# EAGLE design TI_DAC5V (EAGLE 9.6.2)
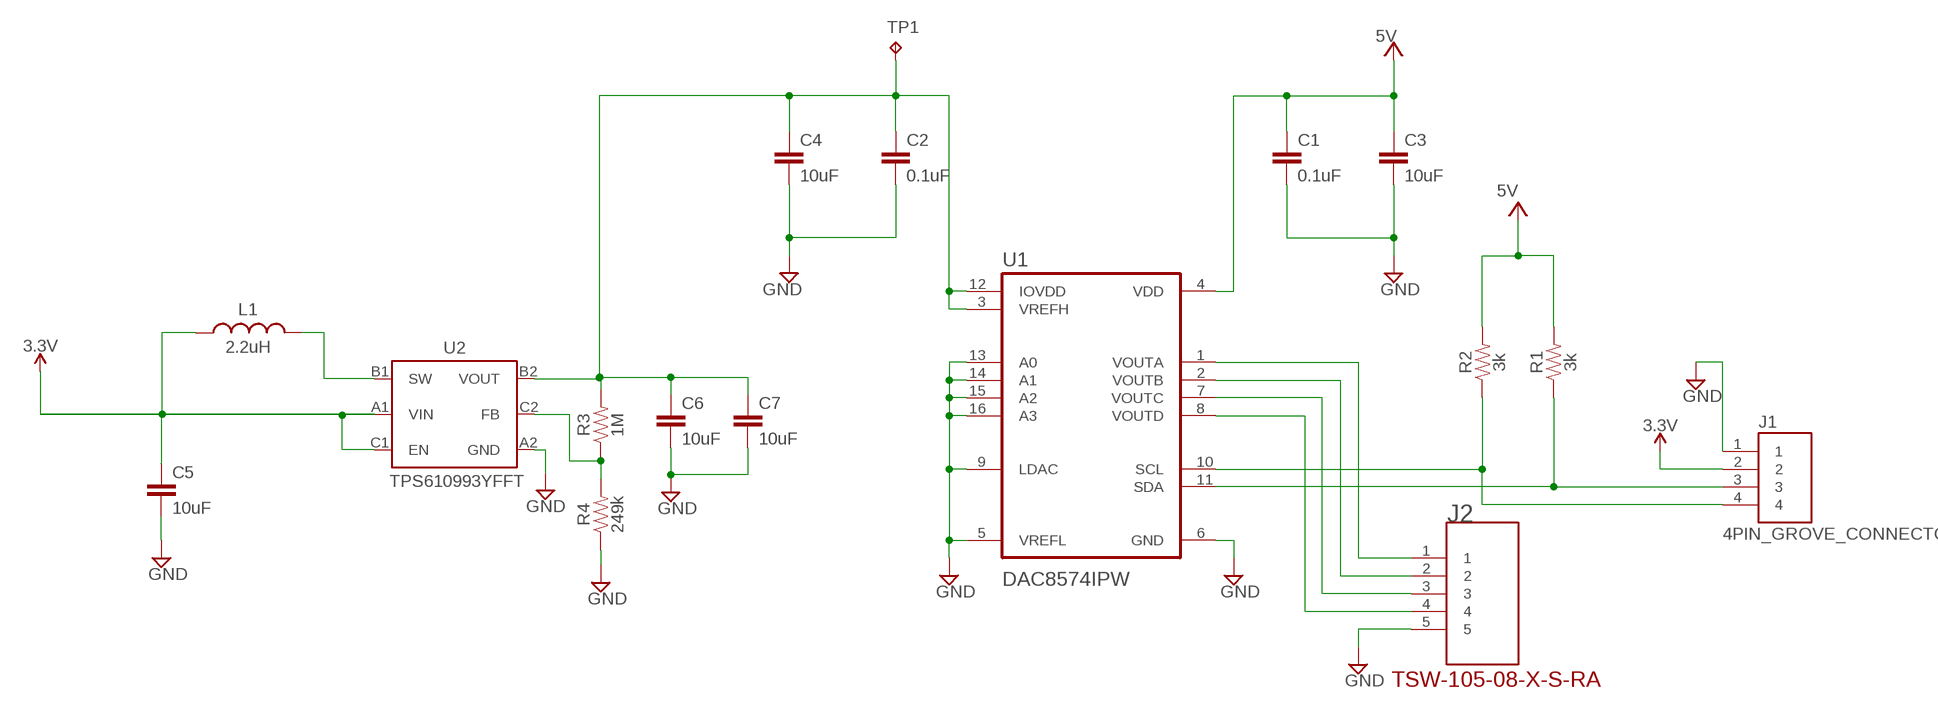
[diagram p0: schematic, sheet 1]

## Parts
C1  0.1uF  0.1UF-1206  [1206]
C2  0.1uF  0.1UF-1206  [1206]
C3  10uF  10UF-1206  [1206]
C4  10uF  10UF-1206  [1206]
C5  10uF  GRM188R60J106ME47J  [CAPC1608X90N]
C6  10uF  GRM188R60J106ME47J  [CAPC1608X90N]
C7  10uF  GRM188R60J106ME47J  [CAPC1608X90N]
J1  4PIN_GROVE_CONNECTOR  [SEEED_114020163]
J2  TSW-105-08-X-S-RAJ  [SAMTEC-TSW-105-08-X-S-RA]
L1  2.2uH  VLS201610CX-2R2M-1  [VLS201610CX-2R2M-1]
R1  3k  3KOHM-1206  [1206]
R2  3k  3KOHM-1206  [1206]
R3  1M  1MOHM  [0603]
R4  249k  249KOHM  [0603]
TP1  TPPAD1-13  [P1-13]
U1  DAC8574IPW  [SOP65P640X120-16N]
U2  TPS610993YFFT  BOOST_CONVERTER  [TPS610993YFFT]

## Nets
3.3V [PWR]: C5.1 J1.2 L1.1 U2.A1(VIN) U2.C1(EN)
5V: C1.1 C2.1 C3.1 C4.1 C6.1 C7.1 R1.2 R2.2 R3.2 TP1.TP U1.3(VREFH) U1.4(VDD) U1.12(IOVDD) U2.B2(VOUT)
FB: R3.1 R4.2 U2.C2(FB)
GND [PWR]: C1.2 C2.2 C3.2 C4.2 C5.2 C6.2 C7.2 J1.1 J2.5 R4.1 U1.5(VREFL) U1.6(GND) U1.9(LDAC) U1.13(A0) U1.14(A1) U1.15(A2) U1.16(A3) U2.A2(GND)
SCL: J1.4 R2.1 U1.10(SCL)
SDA: J1.3 R1.1 U1.11(SDA)
SW: L1.2 U2.B1(SW)
VOUTA [PWR]: J2.1 U1.1(VOUTA)
VOUTB [PWR]: J2.2 U1.2(VOUTB)
VOUTC [PWR]: J2.3 U1.7(VOUTC)
VOUTD [PWR]: J2.4 U1.8(VOUTD)

## Library data of the parts
C1 C2 = MyLib_06_14:0.1UF: 0.1uF ceramic capacitors A capacitor is a passive two-terminal electrical component used to store electrical energy temporarily in an electric field.
C3 C4 = MyLib_06_14:10UF: 10uF ceramic capacitors A capacitor is a passive two-terminal electrical component used to store electrical energy temporarily in an electric field.
C5-C7 = MyLib_06_14:GRM188R60J106ME47J: 10uF Capacitor; AVAILABILITY: In Stock; DESCRIPTION: SMD Capacitor X5R(EIA) with Capacitance: 10uF Tol. 20%. Rated Voltage: 6.3Vdc; MF: Murata; MP: GRM188R60J106ME47J; PACKAGE: 1608 Murata; PRICE: None; PURCHASE-URL: https://pricing.snapeda.com/search/part/GRM188R60J106ME47J/?ref=eda
J1 = MyLib_06_14:4PIN_GROVE_CONNECTOR: Check prices <https://pricing.snapeda.com/parts/110990030/Seeed%20Technology%20Co.%2C%20Ltd/view-part?ref=eda>; AVAILABILITY: In Stock; DESCRIPTION: GROVE 2MM 4PIN VERT CONN 10PCS; MF: Seeed Technology Co., Ltd; MP: 110990030; PACKAGE: None; PRICE: None; PURCHASE-URL: https://pricing.snapeda.com/search/part/110990030/?ref=eda
J2 = MyLib_06_14:TSW-105-08-X-S-RA: TSW - Samtec 2.54mm Right Angle Through Hole Header 2.29mm Solder Tail (08) - Fast Stock. 5 position Connector Header. Check prices <https://pricing.snapeda.com/parts/TSW-105-08-T-S-RA/Samtec/view-part?ref=eda>; AVAILABILITY: In Stock; DESCRIPTION: TSW - Samtec 2.54mm Right Angle Through Hole Header 2.29mm Solder Tail (08) - Fast Stock; MF: Samtec; MP: TSW-105-08-T-S-RA; PACKAGE: None; PRICE: None; PURCHASE-URL: https://pricing.snapeda.com/search/part/TSW-105-08-T-S-RA/?ref=eda
L1 = MyLib_06_14:VLS201610CX-2R2M-1: 2.2uH Inductor
R1 R2 = MyLib_06_14:3KOHM: 3kΩ resistor A resistor is a passive two-terminal electrical component that implements electrical resistance as a circuit element. Resistors act to reduce current flow, and, at the same time, act to lower voltage levels within circuits. - Wikipedia
R3 = MyLib_06_14:1MOHM: Res Thick Film 0402 1M Ohm 1% 1/16W ±100ppm/°C Molded SMD Paper T/R Check prices <https://pricing.snapeda.com/parts/AC0402FR-071ML/Yageo/view-part?ref=eda>
R4 = MyLib_06_14:249KOHM: RES SMD 249K OHM 1% 1/20W 0603 Check prices <https://pricing.snapeda.com/parts/RC0201FR-07249KL/Yageo/view-part?ref=eda>
TP1 = testpad:TP: Test pad
U1 = MyLib_06_14:DAC8574IPW: Check prices <https://pricing.snapeda.com/parts/DAC8574IPW/Texas%20Instruments/view-part?ref=eda>; AVAILABILITY: In Stock; DESCRIPTION: Low-Power Quad Rail-To-Rail Output 16-Bit I2C Input DAC 16-TSSOP -40 to 105; MF: Texas Instruments; MP: DAC8574IPW; PACKAGE: TSSOP-16 Texas Instruments; PRICE: None; PURCHASE-URL: https://pricing.snapeda.com/search/part/DAC8574IPW/?ref=eda
U2 = MyLib_06_14:BOOST_CONVERTER

## Net classes
1 PWR: clearance 0.305 mm

## Board
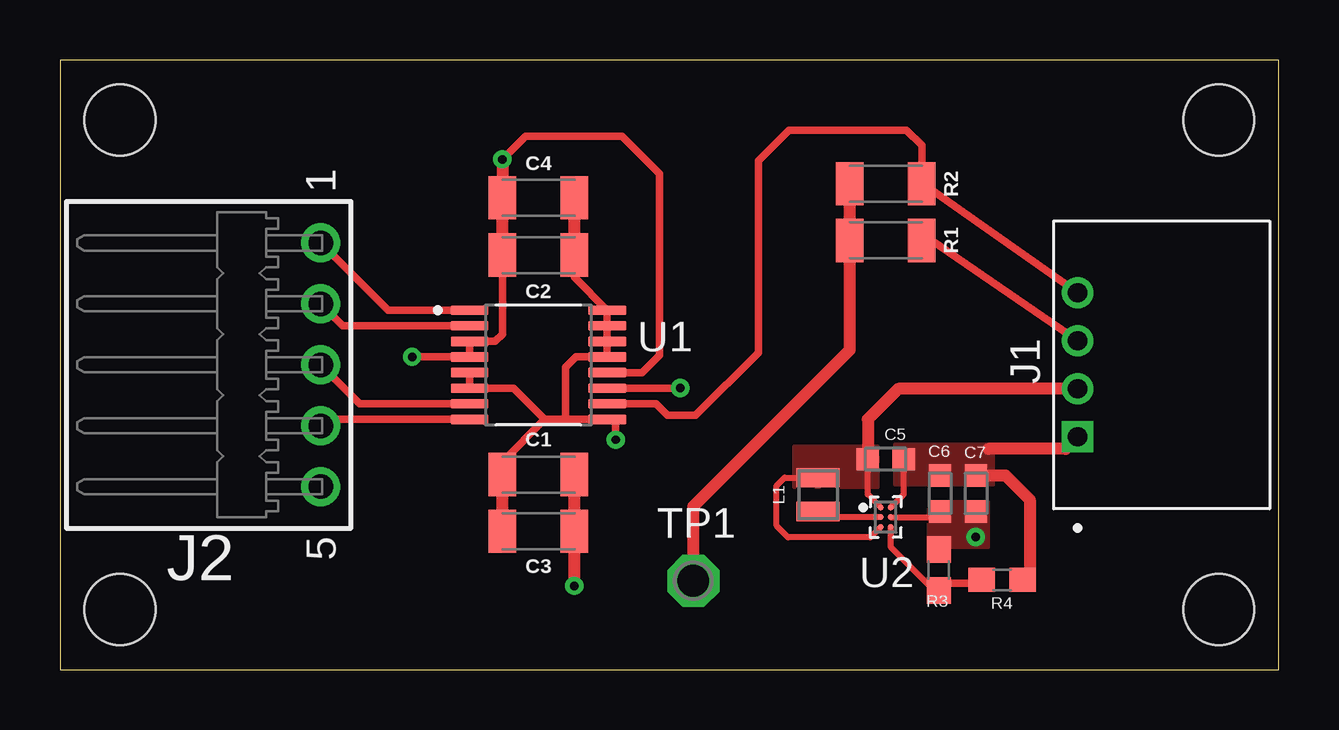
[diagram p1: board, top side]
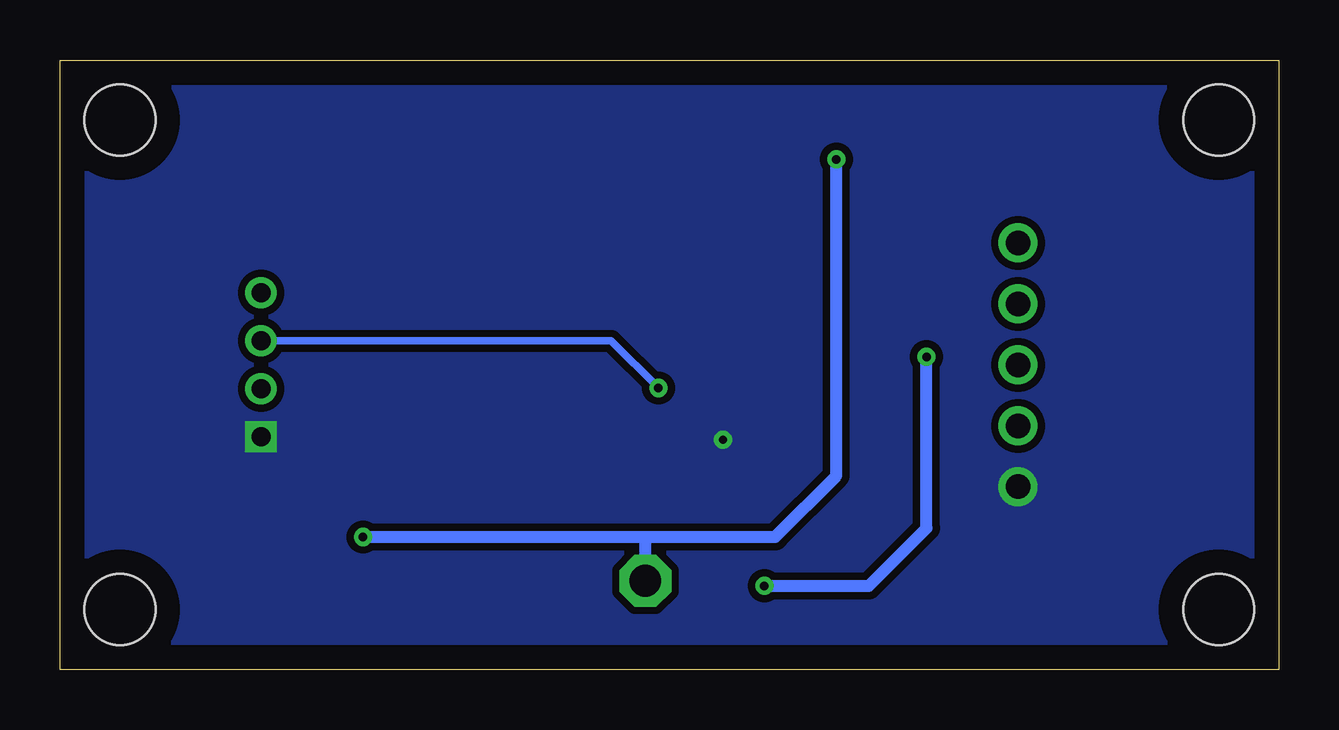
[diagram p2: board, bottom side, seen from below]

Size 50.8 x 25.4 mm. Coordinates in mm from the lower left corner, seen from the top.
Outline: 0,0 50.8,0 50.8,25.4 0,25.4 0,0
Copper layers (1*16): Top 0.035mm / dielectric 1.5mm / Bottom 0.035mm
Design rules "default *": minimum track width 6mil, minimum drill 0.35mm, track to track 6mil, track to pad 6mil, pad to pad 6mil, via to via 6mil, smd to smd 0mil, copper to edge 40mil, drill to drill 6mil, minimum pad ring 10mil, minimum via ring 8mil, stop-mask expansion 4mil, vias tented up to drill 0mil, thermal gap 0mil
Holes 2.95 mm at 2.5,22.9 48.3,22.9 48.3,2.5 2.5,2.5

### Footprints (pad centres in the part's own frame; a part is rotated, then mirrored left to right if it is on the bottom)
1206 = smd 1.15 x 1.8: 1 -1.5,0; 2 1.5,0
CAPC1608X90N = smd 0.93 x 0.93: 1 -0.75,0; 2 0.75,0
SEEED_114020163 = drill 0.8 square: 1 -3,0 | drill 0.8: 2 -1,0; 3 1,0; 4 3,0
SAMTEC-TSW-105-08-X-S-RA = drill 1.02 pad 1.62: 1 -5.08,3.048; 2 -2.54,3.048; 3 0,3.048; 4 2.54,3.048; 5 5.08,3.048
VLS201610CX-2R2M-1 = smd 0.8 x 1.8: 1 -0.7,0; 2 0.7,0
0603 = smd 1.1 x 1: 1 -0.85,0; 2 0.85,0
P1-13 = drill 1.321 pad 2.159 octagon: TP 0,0
SOP65P640X120-16N = smd 1.57 x 0.41: 1 -2.87,2.275; 2 -2.87,1.625; 3 -2.87,0.975; 4 -2.87,0.325; 5 -2.87,-0.325; 6 -2.87,-0.975; 7 -2.87,-1.625; 8 -2.87,-2.275; 9 2.87,-2.275; 10 2.87,-1.625; 11 2.87,-0.975; 12 2.87,-0.325; 13 2.87,0.325; 14 2.87,0.975; 15 2.87,1.625; 16 2.87,2.275
TPS610993YFFT = smd 0.25 x 0.25: A1 -0.2,0.4; A2 0.2,0.4; B1 -0.2,0; B2 0.2,0; C1 -0.2,-0.4; C2 0.2,-0.4

### Placement (x,y rotation side)
C1  19.94,8.13 180 top
C2  19.94,17.27 0 top
C3  19.94,5.77 180 top
C4  19.94,19.66 0 top
C5  34.42,8.76 0 top
C6  36.68,7.34 90 top
C7  38.18,7.34 90 top
J1  42.42,12.7 90 top
J2  7.82,12.7 270 top
L1  31.6,7.29 270 top
R1  34.42,17.88 180 top
R2  34.42,20.24 180 top
R3  36.63,4.15 90 top
R4  39.27,3.74 180 top
TP1  26.4,3.7 0 top
U1  19.94,12.7 0 top
U2  34.42,6.35 0 top

### Tracks (layer width: path | path; a pad name or v marks a point on that pad's centre or on a via)
3.3V
  Top 0.254: U2.A1 33.67,7.3 C5.1 | U2.C1 33.78,5.51 30.35,5.51 29.87,5.99 29.87,7.67 30.2,8 31.59,8 L1.1
  Top 0.508: J1.2 34.94,11.7 33.67,10.43 C5.1
  pour Top: 30.6,9.3 30.6,7.6 34.1,7.6 34.1,9.3
5V  (via drill 0.35)
  Top 0.254: U2.B2 36.44,6.35
  Top 0.305: 36.44,6.35 C6.1 | C2.1 18.44,13.97 18.14,13.68 U1.3 U1.4 v14.68,13.03 | v18.44,21.26 19.41,22.23 23.42,22.23 24.99,20.65 24.99,13.11 24.26,12.38 U1.12
  Top 0.508: C2.1 C4.1 v18.44,21.26 | C1.1 C3.1 v21.44,3.49 | R2.2 R1.2 32.92,13.32 26.4,6.8 TP1.TP
  Bottom 0.508: v38.17,5.53 26.4,5.53 | 26.4,5.53 20.99,5.53 18.44,8.08 v18.44,21.26 | TP1.TP 26.4,5.53 | v21.44,3.49 17.08,3.49 14.68,5.89 v14.68,13.03
  pour Top: 36.2,7 36.2,5.1 38.7,5.1 38.7,7
FB
  Top 0.254: U2.C2 34.62,5.11 36.42,3.3 R3.1
  Top 0.305: R3.1 36.92,3.6 37.98,3.6 38.12,3.74 R4.2
GND  (via drill 0.35)
  Top 0.254: U2.A2 35.17,7.3 C5.2
  Top 0.305: U1.5 U1.6 18.9,11.72 20.2,10.43 | v23.16,9.58 23.16,10.35 23.09,10.43 U1.9 21.08,10.43 | C1.2 18.44,8.66 20.2,10.43 | 20.2,10.43 21.08,10.43 | C2.2 21.44,16.34 U1.16 U1.15 U1.14 U1.13 21.51,13.03 21.08,12.6 21.08,10.43
  Top 0.508: C2.2 C4.2 | C3.2 C1.2 | C7.2 39.41,8.09 40.42,7.08 40.42,4.04 R4.1 | 38.7,9.2 41.92,9.2 J1.1
  pour Bottom: 0,0 0,25.4 50.8,25.4 50.8,0
  pour Top: 34.8,9.4 34.8,7.7 38.9,7.7 38.9,9.4
SCL
  Top 0.305: J1.4 35.97,20.24 R2.1 35.92,21.84 35.28,22.48 30.38,22.48 29.11,21.21 29.11,13.21 26.49,10.59 25.32,10.59 24.84,11.07 U1.10
SDA  (via drill 0.35)
  Top 0.305: U1.11 25.85,11.72 v25.86,11.73 | J1.3 36.33,17.88 R1.1
  Bottom 0.305: J1.3 27.82,13.7 v25.86,11.73
SW
  Top 0.254: U2.B1 31.84,6.35
  Top 0.305: 31.84,6.35 L1.2
VOUTA
  Top 0.305: U1.1 13.68,14.97 J2.1
VOUTB
  Top 0.305: U1.2 11.79,14.32 J2.2
VOUTC
  Top 0.305: U1.7 12.5,11.07 J2.3
VOUTD
  Top 0.305: U1.8 11.14,10.43 J2.4